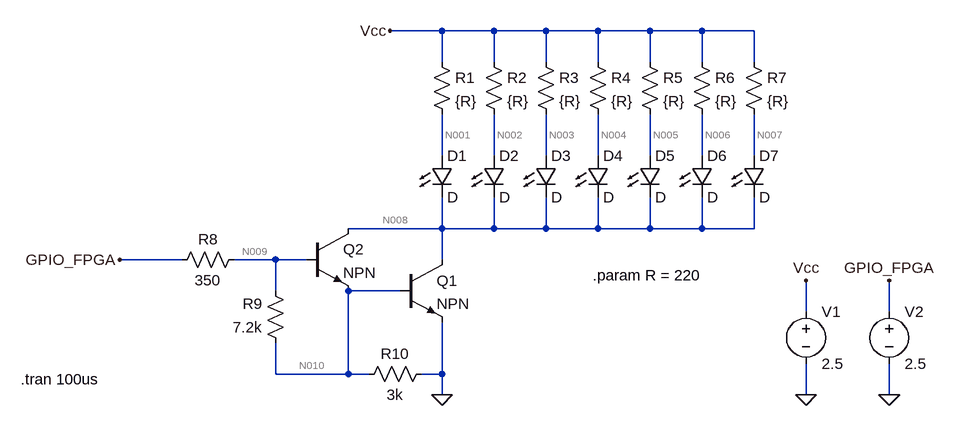
[diagram p0: schematic ULN2064B_test.asc]
ULN2064B_test.asc, the LTspice schematic file:
Version 4
SHEET 1 960 680
WIRE 208 -256 128 -256
WIRE 288 -256 208 -256
WIRE 368 -256 288 -256
WIRE 448 -256 368 -256
WIRE 528 -256 448 -256
WIRE 608 -256 528 -256
WIRE 688 -256 608 -256
WIRE 208 -208 208 -256
WIRE 288 -208 288 -256
WIRE 368 -208 368 -256
WIRE 448 -208 448 -256
WIRE 528 -208 528 -256
WIRE 608 -208 608 -256
WIRE 688 -208 688 -256
WIRE 208 -64 208 -128
WIRE 288 -64 288 -128
WIRE 368 -64 368 -128
WIRE 448 -64 448 -128
WIRE 528 -64 528 -128
WIRE 608 -64 608 -128
WIRE 688 -64 688 -128
WIRE 208 48 208 0
WIRE 208 48 64 48
WIRE 288 48 288 0
WIRE 288 48 208 48
WIRE 368 48 368 0
WIRE 368 48 288 48
WIRE 448 48 448 0
WIRE 448 48 368 48
WIRE 528 48 528 0
WIRE 528 48 448 48
WIRE 608 48 608 0
WIRE 608 48 528 48
WIRE 688 48 688 0
WIRE 688 48 608 48
WIRE -192 96 -288 96
WIRE -48 96 -112 96
WIRE 0 96 -48 96
WIRE 208 96 208 48
WIRE -48 144 -48 96
WIRE 144 144 64 144
WIRE 768 176 768 128
WIRE 896 176 896 128
WIRE -48 272 -48 224
WIRE 64 272 64 144
WIRE 64 272 -48 272
WIRE 96 272 64 272
WIRE 208 272 208 192
WIRE 208 272 176 272
WIRE 208 304 208 272
WIRE 768 304 768 256
WIRE 896 304 896 256
FLAG 208 304 0
FLAG -288 96 GPIO_FPGA
FLAG 128 -256 Vcc
FLAG 768 304 0
FLAG 768 128 Vcc
FLAG 896 304 0
FLAG 896 128 GPIO_FPGA
SYMBOL npn 144 96 R0
SYMATTR InstName Q1
SYMBOL LED 192 -64 R0
SYMATTR InstName D1
SYMBOL LED 272 -64 R0
SYMATTR InstName D2
SYMBOL LED 352 -64 R0
SYMATTR InstName D3
SYMBOL LED 432 -64 R0
SYMATTR InstName D4
SYMBOL LED 512 -64 R0
SYMATTR InstName D5
SYMBOL LED 592 -64 R0
SYMATTR InstName D6
SYMBOL LED 672 -64 R0
SYMATTR InstName D7
SYMBOL res 192 -224 R0
SYMATTR InstName R1
SYMATTR Value {R}
SYMBOL res 272 -224 R0
SYMATTR InstName R2
SYMATTR Value {R}
SYMBOL res 352 -224 R0
SYMATTR InstName R3
SYMATTR Value {R}
SYMBOL res 432 -224 R0
SYMATTR InstName R4
SYMATTR Value {R}
SYMBOL res 512 -224 R0
SYMATTR InstName R5
SYMATTR Value {R}
SYMBOL res 592 -224 R0
SYMATTR InstName R6
SYMATTR Value {R}
SYMBOL res 672 -224 R0
SYMATTR InstName R7
SYMATTR Value {R}
SYMBOL res -96 80 R90
WINDOW 0 0 56 VBottom 2
WINDOW 3 32 56 VTop 2
SYMATTR InstName R8
SYMATTR Value 350
SYMBOL res -32 240 R180
WINDOW 0 36 76 Left 2
WINDOW 3 36 40 Left 2
SYMATTR InstName R9
SYMATTR Value 7.2k
SYMBOL voltage 768 160 R0
WINDOW 123 0 0 Left 0
WINDOW 39 0 0 Left 0
SYMATTR InstName V1
SYMATTR Value 2.5
SYMBOL voltage 896 160 R0
WINDOW 123 0 0 Left 0
WINDOW 39 0 0 Left 0
SYMATTR InstName V2
SYMATTR Value 2.5
SYMBOL npn 0 48 R0
SYMATTR InstName Q2
SYMBOL res 192 256 R90
WINDOW 0 0 56 VBottom 2
WINDOW 3 32 56 VTop 2
SYMATTR InstName R10
SYMATTR Value 3k
TEXT 440 120 Left 2 !.param R = 220
TEXT -440 280 Left 2 !.tran 100us

The netlist it stands for:
* ULN2064B_test.asc
Q1 N008 N010 0 0 NPN
D1 N001 N008 D
D2 N002 N008 D
D3 N003 N008 D
D4 N004 N008 D
D5 N005 N008 D
D6 N006 N008 D
D7 N007 N008 D
R1 Vcc N001 {R}
R2 Vcc N002 {R}
R3 Vcc N003 {R}
R4 Vcc N004 {R}
R5 Vcc N005 {R}
R6 Vcc N006 {R}
R7 Vcc N007 {R}
R8 N009 GPIO_FPGA 350
R9 N010 N009 7.2k
V1 Vcc 0 2.5
V2 GPIO_FPGA 0 2.5
Q2 N008 N009 N010 0 NPN
R10 0 N010 3k
.model D D
.lib standard.dio
.model NPN NPN
.model PNP PNP
.lib standard.bjt
.param R = 220
.tran 100us
.backanno
.end

* Results of the author's LTspice run, read from the files saved beside the schematic
* Operating Point, zero values left out:
*   V(n008) = 868.5 mV
*   V(n010) = 863.6 mV
*   V(n001) = 1.561 V
*   V(n002) = 1.561 V
*   V(n003) = 1.561 V
*   V(n004) = 1.561 V
*   V(n005) = 1.561 V
*   V(n006) = 1.561 V
*   V(n007) = 1.561 V
*   V(vcc) = 2.5 V
*   V(n009) = 1.664 V
*   V(gpio_fpga) = 2.5 V
*   Ic(Q2) = -1.785 mA
*   Ib(Q2) = 2.278 mA
*   Ie(Q2) = -493.3 µA
*   Ic(Q1) = 31.66 mA
*   Ib(Q1) = 316.6 µA
*   Ie(Q1) = -31.98 mA
*   I(D7) = 4.268 mA
*   I(D6) = 4.268 mA
*   I(D5) = 4.268 mA
*   I(D4) = 4.268 mA
*   I(D3) = 4.268 mA
*   I(D2) = 4.268 mA
*   I(D1) = 4.268 mA
*   I(R10) = -287.9 µA
*   I(R9) = -111.1 µA
*   I(R8) = -2.389 mA
*   I(R7) = 4.268 mA
*   I(R6) = 4.268 mA
*   I(R5) = 4.268 mA
*   I(R4) = 4.268 mA
*   I(R3) = 4.268 mA
*   I(R2) = 4.268 mA
*   I(R1) = 4.268 mA
*   I(V2) = -2.389 mA
*   I(V1) = -29.87 mA